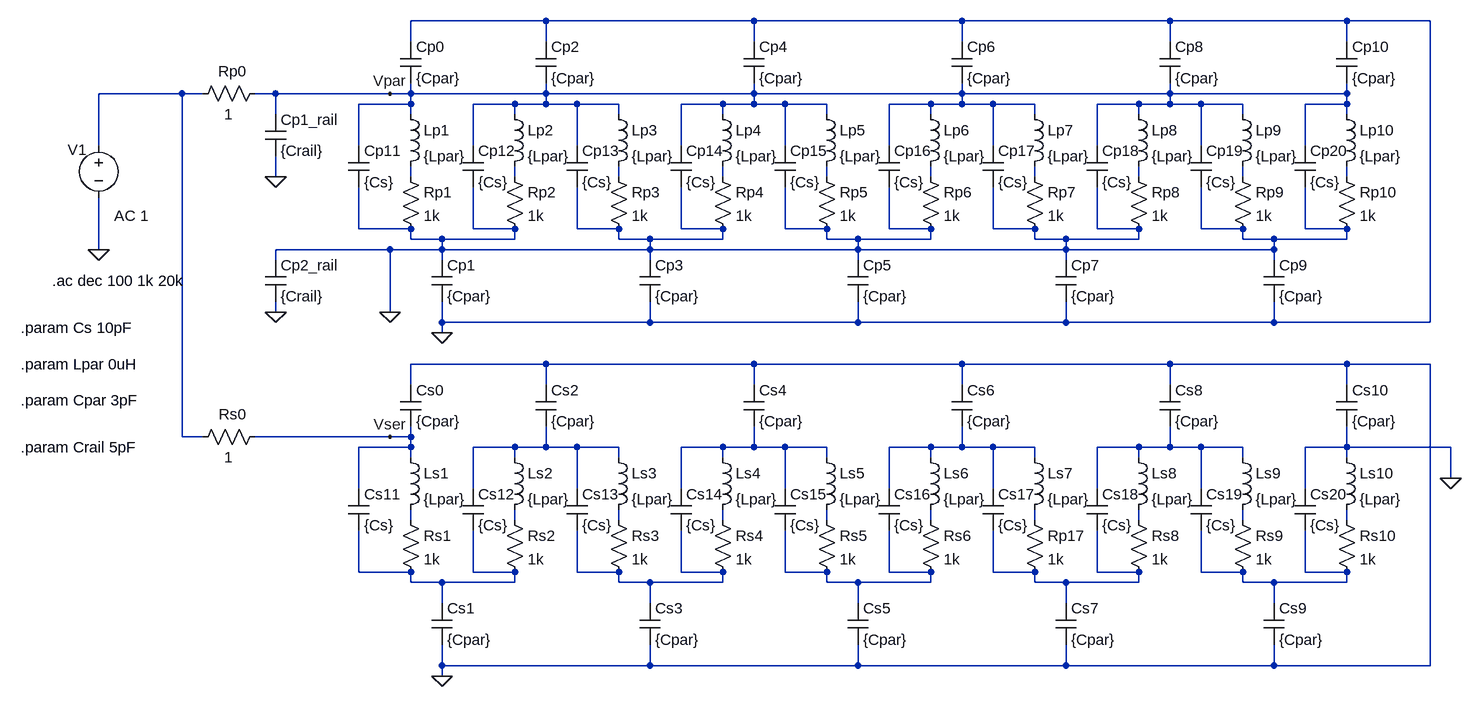
[diagram p0: schematic Hamon_RLC_Transfer.asc]
Hamon_RLC_Transfer.asc, the LTspice schematic file:
Version 4
SHEET 1 1508 1156
WIRE 48 -80 -160 -80
WIRE 368 -80 48 -80
WIRE 688 -80 368 -80
WIRE 1008 -80 688 -80
WIRE 1280 -80 1008 -80
WIRE 1408 -80 1280 -80
WIRE -160 -48 -160 -80
WIRE 48 -48 48 -80
WIRE 368 -48 368 -80
WIRE 688 -48 688 -80
WIRE 1008 -48 1008 -80
WIRE 1280 -48 1280 -80
WIRE -512 32 -640 32
WIRE -480 32 -512 32
WIRE -368 32 -400 32
WIRE -192 32 -368 32
WIRE -160 32 -160 16
WIRE -160 32 -192 32
WIRE 48 32 48 16
WIRE 48 32 -160 32
WIRE 368 32 368 16
WIRE 368 32 48 32
WIRE 688 32 688 16
WIRE 688 32 368 32
WIRE 1008 32 1008 16
WIRE 1008 32 688 32
WIRE 1280 32 1280 16
WIRE 1280 32 1008 32
WIRE -160 48 -160 32
WIRE -160 48 -240 48
WIRE 0 48 -64 48
WIRE 48 48 48 32
WIRE 48 48 0 48
WIRE 96 48 48 48
WIRE 160 48 96 48
WIRE 320 48 256 48
WIRE 368 48 368 32
WIRE 368 48 320 48
WIRE 416 48 368 48
WIRE 480 48 416 48
WIRE 640 48 576 48
WIRE 688 48 688 32
WIRE 688 48 640 48
WIRE 736 48 688 48
WIRE 800 48 736 48
WIRE 960 48 896 48
WIRE 1008 48 1008 32
WIRE 1008 48 960 48
WIRE 1056 48 1008 48
WIRE 1120 48 1056 48
WIRE 1280 48 1280 32
WIRE 1280 48 1216 48
WIRE -368 64 -368 32
WIRE -160 64 -160 48
WIRE 0 64 0 48
WIRE 160 64 160 48
WIRE 320 64 320 48
WIRE 480 64 480 48
WIRE 640 64 640 48
WIRE 800 64 800 48
WIRE 960 64 960 48
WIRE 1120 64 1120 48
WIRE 1280 64 1280 48
WIRE -640 112 -640 32
WIRE -240 112 -240 48
WIRE -64 112 -64 48
WIRE 96 112 96 48
WIRE 256 112 256 48
WIRE 416 112 416 48
WIRE 576 112 576 48
WIRE 736 112 736 48
WIRE 896 112 896 48
WIRE 1056 112 1056 48
WIRE 1216 112 1216 48
WIRE -368 160 -368 128
WIRE -160 160 -160 144
WIRE 0 160 0 144
WIRE 160 160 160 144
WIRE 320 160 320 144
WIRE 480 160 480 144
WIRE 640 160 640 144
WIRE 800 160 800 144
WIRE 960 160 960 144
WIRE 1120 160 1120 144
WIRE 1280 160 1280 144
WIRE -240 240 -240 176
WIRE -160 240 -240 240
WIRE -64 240 -64 176
WIRE 0 240 -64 240
WIRE 96 240 96 176
WIRE 160 240 96 240
WIRE 256 240 256 176
WIRE 320 240 256 240
WIRE 416 240 416 176
WIRE 480 240 416 240
WIRE 576 240 576 176
WIRE 640 240 576 240
WIRE 736 240 736 176
WIRE 800 240 736 240
WIRE 896 240 896 176
WIRE 960 240 896 240
WIRE 1056 240 1056 176
WIRE 1120 240 1056 240
WIRE 1216 240 1216 176
WIRE 1280 240 1216 240
WIRE -160 256 -160 240
WIRE -112 256 -160 256
WIRE 0 256 0 240
WIRE 0 256 -112 256
WIRE 160 256 160 240
WIRE 208 256 160 256
WIRE 320 256 320 240
WIRE 320 256 208 256
WIRE 480 256 480 240
WIRE 528 256 480 256
WIRE 640 256 640 240
WIRE 640 256 528 256
WIRE 800 256 800 240
WIRE 848 256 800 256
WIRE 960 256 960 240
WIRE 960 256 848 256
WIRE 1120 256 1120 240
WIRE 1168 256 1120 256
WIRE 1280 256 1280 240
WIRE 1280 256 1168 256
WIRE -640 272 -640 192
WIRE -192 272 -368 272
WIRE -112 272 -112 256
WIRE -112 272 -192 272
WIRE 208 272 208 256
WIRE 208 272 -112 272
WIRE 528 272 528 256
WIRE 528 272 208 272
WIRE 848 272 848 256
WIRE 848 272 528 272
WIRE 1168 272 1168 256
WIRE 1168 272 848 272
WIRE -368 288 -368 272
WIRE -112 288 -112 272
WIRE 208 288 208 272
WIRE 528 288 528 272
WIRE 848 288 848 272
WIRE 1168 288 1168 272
WIRE -368 368 -368 352
WIRE -192 368 -192 272
WIRE -112 384 -112 352
WIRE 208 384 208 352
WIRE 208 384 -112 384
WIRE 528 384 528 352
WIRE 528 384 208 384
WIRE 848 384 848 352
WIRE 848 384 528 384
WIRE 1168 384 1168 352
WIRE 1168 384 848 384
WIRE 1408 384 1408 -80
WIRE 1408 384 1168 384
WIRE -112 400 -112 384
WIRE 48 448 -160 448
WIRE 368 448 48 448
WIRE 688 448 368 448
WIRE 1008 448 688 448
WIRE 1280 448 1008 448
WIRE 1408 448 1280 448
WIRE -160 480 -160 448
WIRE 48 480 48 448
WIRE 368 480 368 448
WIRE 688 480 688 448
WIRE 1008 480 1008 448
WIRE 1280 480 1280 448
WIRE -512 560 -512 32
WIRE -480 560 -512 560
WIRE -192 560 -400 560
WIRE -160 560 -160 544
WIRE -160 560 -192 560
WIRE -160 576 -160 560
WIRE -160 576 -240 576
WIRE 0 576 -64 576
WIRE 48 576 48 544
WIRE 48 576 0 576
WIRE 96 576 48 576
WIRE 160 576 96 576
WIRE 320 576 256 576
WIRE 368 576 368 544
WIRE 368 576 320 576
WIRE 416 576 368 576
WIRE 480 576 416 576
WIRE 640 576 576 576
WIRE 688 576 688 544
WIRE 688 576 640 576
WIRE 736 576 688 576
WIRE 800 576 736 576
WIRE 960 576 896 576
WIRE 1008 576 1008 544
WIRE 1008 576 960 576
WIRE 1056 576 1008 576
WIRE 1120 576 1056 576
WIRE 1280 576 1280 544
WIRE 1280 576 1216 576
WIRE 1440 576 1280 576
WIRE -160 592 -160 576
WIRE 0 592 0 576
WIRE 160 592 160 576
WIRE 320 592 320 576
WIRE 480 592 480 576
WIRE 640 592 640 576
WIRE 800 592 800 576
WIRE 960 592 960 576
WIRE 1120 592 1120 576
WIRE 1280 592 1280 576
WIRE 1440 624 1440 576
WIRE -240 640 -240 576
WIRE -64 640 -64 576
WIRE 96 640 96 576
WIRE 256 640 256 576
WIRE 416 640 416 576
WIRE 576 640 576 576
WIRE 736 640 736 576
WIRE 896 640 896 576
WIRE 1056 640 1056 576
WIRE 1216 640 1216 576
WIRE -160 688 -160 672
WIRE 0 688 0 672
WIRE 160 688 160 672
WIRE 320 688 320 672
WIRE 480 688 480 672
WIRE 640 688 640 672
WIRE 800 688 800 672
WIRE 960 688 960 672
WIRE 1120 688 1120 672
WIRE 1280 688 1280 672
WIRE -240 768 -240 704
WIRE -160 768 -240 768
WIRE -64 768 -64 704
WIRE 0 768 -64 768
WIRE 96 768 96 704
WIRE 160 768 96 768
WIRE 256 768 256 704
WIRE 320 768 256 768
WIRE 416 768 416 704
WIRE 480 768 416 768
WIRE 576 768 576 704
WIRE 640 768 576 768
WIRE 736 768 736 704
WIRE 800 768 736 768
WIRE 896 768 896 704
WIRE 960 768 896 768
WIRE 1056 768 1056 704
WIRE 1120 768 1056 768
WIRE 1216 768 1216 704
WIRE 1280 768 1216 768
WIRE -160 784 -160 768
WIRE -112 784 -160 784
WIRE 0 784 0 768
WIRE 0 784 -112 784
WIRE 160 784 160 768
WIRE 208 784 160 784
WIRE 320 784 320 768
WIRE 320 784 208 784
WIRE 480 784 480 768
WIRE 528 784 480 784
WIRE 640 784 640 768
WIRE 640 784 528 784
WIRE 800 784 800 768
WIRE 848 784 800 784
WIRE 960 784 960 768
WIRE 960 784 848 784
WIRE 1120 784 1120 768
WIRE 1168 784 1120 784
WIRE 1280 784 1280 768
WIRE 1280 784 1168 784
WIRE -112 816 -112 784
WIRE 208 816 208 784
WIRE 528 816 528 784
WIRE 848 816 848 784
WIRE 1168 816 1168 784
WIRE -112 912 -112 880
WIRE 208 912 208 880
WIRE 208 912 -112 912
WIRE 528 912 528 880
WIRE 528 912 208 912
WIRE 848 912 848 880
WIRE 848 912 528 912
WIRE 1168 912 1168 880
WIRE 1168 912 848 912
WIRE 1408 912 1408 448
WIRE 1408 912 1168 912
WIRE -112 928 -112 912
FLAG -640 272 0
FLAG -112 400 0
FLAG -192 32 Vpar
FLAG -192 368 0
FLAG -368 160 0
FLAG -112 928 0
FLAG -192 560 Vser
FLAG 1440 624 0
FLAG -368 368 0
SYMBOL res -176 144 R0
SYMATTR InstName Rp1
SYMATTR Value 1k
SYMBOL res -16 144 R0
SYMATTR InstName Rp2
SYMATTR Value 1k
SYMBOL res 144 144 R0
SYMATTR InstName Rp3
SYMATTR Value 1k
SYMBOL res 304 144 R0
SYMATTR InstName Rp4
SYMATTR Value 1k
SYMBOL res 464 144 R0
SYMATTR InstName Rp5
SYMATTR Value 1k
SYMBOL res 624 144 R0
SYMATTR InstName Rp6
SYMATTR Value 1k
SYMBOL res 784 144 R0
SYMATTR InstName Rp7
SYMATTR Value 1k
SYMBOL res 944 144 R0
SYMATTR InstName Rp8
SYMATTR Value 1k
SYMBOL res 1104 144 R0
SYMATTR InstName Rp9
SYMATTR Value 1k
SYMBOL res 1264 144 R0
SYMATTR InstName Rp10
SYMATTR Value 1k
SYMBOL ind -176 48 R0
SYMATTR InstName Lp1
SYMATTR Value {Lpar}
SYMBOL ind -16 48 R0
SYMATTR InstName Lp2
SYMATTR Value {Lpar}
SYMBOL ind 144 48 R0
SYMATTR InstName Lp3
SYMATTR Value {Lpar}
SYMBOL ind 304 48 R0
SYMATTR InstName Lp4
SYMATTR Value {Lpar}
SYMBOL ind 464 48 R0
SYMATTR InstName Lp5
SYMATTR Value {Lpar}
SYMBOL ind 624 48 R0
SYMATTR InstName Lp6
SYMATTR Value {Lpar}
SYMBOL ind 784 48 R0
SYMATTR InstName Lp7
SYMATTR Value {Lpar}
SYMBOL ind 944 48 R0
SYMATTR InstName Lp8
SYMATTR Value {Lpar}
SYMBOL ind 1104 48 R0
SYMATTR InstName Lp9
SYMATTR Value {Lpar}
SYMBOL ind 1264 48 R0
SYMATTR InstName Lp10
SYMATTR Value {Lpar}
SYMBOL cap -128 288 R0
SYMATTR InstName Cp1
SYMATTR Value {Cpar}
SYMBOL cap 32 -48 R0
SYMATTR InstName Cp2
SYMATTR Value {Cpar}
SYMBOL cap 192 288 R0
SYMATTR InstName Cp3
SYMATTR Value {Cpar}
SYMBOL cap 352 -48 R0
SYMATTR InstName Cp4
SYMATTR Value {Cpar}
SYMBOL cap 512 288 R0
SYMATTR InstName Cp5
SYMATTR Value {Cpar}
SYMBOL cap 672 -48 R0
SYMATTR InstName Cp6
SYMATTR Value {Cpar}
SYMBOL cap 832 288 R0
SYMATTR InstName Cp7
SYMATTR Value {Cpar}
SYMBOL cap 992 -48 R0
SYMATTR InstName Cp8
SYMATTR Value {Cpar}
SYMBOL cap 1152 288 R0
SYMATTR InstName Cp9
SYMATTR Value {Cpar}
SYMBOL cap 1264 -48 R0
SYMATTR InstName Cp10
SYMATTR Value {Cpar}
SYMBOL cap -176 -48 R0
SYMATTR InstName Cp0
SYMATTR Value {Cpar}
SYMBOL voltage -640 96 R0
WINDOW 123 24 124 Left 2
WINDOW 39 0 0 Left 0
WINDOW 0 -48 22 Left 2
SYMATTR Value2 AC 1
SYMATTR InstName V1
SYMATTR Value ""
SYMBOL res -384 16 R90
WINDOW 0 -3 50 VBottom 2
WINDOW 3 32 56 VTop 2
SYMATTR InstName Rp0
SYMATTR Value 1
SYMBOL cap -256 112 R0
SYMATTR InstName Cp11
SYMATTR Value {Cs}
SYMBOL cap -80 112 R0
SYMATTR InstName Cp12
SYMATTR Value {Cs}
SYMBOL cap 80 112 R0
SYMATTR InstName Cp13
SYMATTR Value {Cs}
SYMBOL cap 240 112 R0
SYMATTR InstName Cp14
SYMATTR Value {Cs}
SYMBOL cap 400 112 R0
SYMATTR InstName Cp15
SYMATTR Value {Cs}
SYMBOL cap 560 112 R0
SYMATTR InstName Cp16
SYMATTR Value {Cs}
SYMBOL cap 720 112 R0
SYMATTR InstName Cp17
SYMATTR Value {Cs}
SYMBOL cap 880 112 R0
SYMATTR InstName Cp18
SYMATTR Value {Cs}
SYMBOL cap 1040 112 R0
SYMATTR InstName Cp19
SYMATTR Value {Cs}
SYMBOL cap 1200 112 R0
SYMATTR InstName Cp20
SYMATTR Value {Cs}
SYMBOL cap -384 64 R0
SYMATTR InstName Cp1_rail
SYMATTR Value {Crail}
SYMBOL res -176 672 R0
SYMATTR InstName Rs1
SYMATTR Value 1k
SYMBOL res -16 672 R0
SYMATTR InstName Rs2
SYMATTR Value 1k
SYMBOL res 144 672 R0
SYMATTR InstName Rs3
SYMATTR Value 1k
SYMBOL res 304 672 R0
SYMATTR InstName Rs4
SYMATTR Value 1k
SYMBOL res 464 672 R0
SYMATTR InstName Rs5
SYMATTR Value 1k
SYMBOL res 624 672 R0
SYMATTR InstName Rs6
SYMATTR Value 1k
SYMBOL res 784 672 R0
SYMATTR InstName Rp17
SYMATTR Value 1k
SYMBOL res 944 672 R0
SYMATTR InstName Rs8
SYMATTR Value 1k
SYMBOL res 1104 672 R0
SYMATTR InstName Rs9
SYMATTR Value 1k
SYMBOL res 1264 672 R0
SYMATTR InstName Rs10
SYMATTR Value 1k
SYMBOL ind -176 576 R0
SYMATTR InstName Ls1
SYMATTR Value {Lpar}
SYMBOL ind -16 576 R0
SYMATTR InstName Ls2
SYMATTR Value {Lpar}
SYMBOL ind 144 576 R0
SYMATTR InstName Ls3
SYMATTR Value {Lpar}
SYMBOL ind 304 576 R0
SYMATTR InstName Ls4
SYMATTR Value {Lpar}
SYMBOL ind 464 576 R0
SYMATTR InstName Ls5
SYMATTR Value {Lpar}
SYMBOL ind 624 576 R0
SYMATTR InstName Ls6
SYMATTR Value {Lpar}
SYMBOL ind 784 576 R0
SYMATTR InstName Ls7
SYMATTR Value {Lpar}
SYMBOL ind 944 576 R0
SYMATTR InstName Ls8
SYMATTR Value {Lpar}
SYMBOL ind 1104 576 R0
SYMATTR InstName Ls9
SYMATTR Value {Lpar}
SYMBOL ind 1264 576 R0
SYMATTR InstName Ls10
SYMATTR Value {Lpar}
SYMBOL cap -128 816 R0
SYMATTR InstName Cs1
SYMATTR Value {Cpar}
SYMBOL cap 32 480 R0
SYMATTR InstName Cs2
SYMATTR Value {Cpar}
SYMBOL cap 192 816 R0
SYMATTR InstName Cs3
SYMATTR Value {Cpar}
SYMBOL cap 352 480 R0
SYMATTR InstName Cs4
SYMATTR Value {Cpar}
SYMBOL cap 512 816 R0
SYMATTR InstName Cs5
SYMATTR Value {Cpar}
SYMBOL cap 672 480 R0
SYMATTR InstName Cs6
SYMATTR Value {Cpar}
SYMBOL cap 832 816 R0
SYMATTR InstName Cs7
SYMATTR Value {Cpar}
SYMBOL cap 992 480 R0
SYMATTR InstName Cs8
SYMATTR Value {Cpar}
SYMBOL cap 1152 816 R0
SYMATTR InstName Cs9
SYMATTR Value {Cpar}
SYMBOL cap 1264 480 R0
SYMATTR InstName Cs10
SYMATTR Value {Cpar}
SYMBOL cap -176 480 R0
SYMATTR InstName Cs0
SYMATTR Value {Cpar}
SYMBOL res -384 544 R90
WINDOW 0 -3 50 VBottom 2
WINDOW 3 32 56 VTop 2
SYMATTR InstName Rs0
SYMATTR Value 1
SYMBOL cap -256 640 R0
SYMATTR InstName Cs11
SYMATTR Value {Cs}
SYMBOL cap -80 640 R0
SYMATTR InstName Cs12
SYMATTR Value {Cs}
SYMBOL cap 80 640 R0
SYMATTR InstName Cs13
SYMATTR Value {Cs}
SYMBOL cap 240 640 R0
SYMATTR InstName Cs14
SYMATTR Value {Cs}
SYMBOL cap 400 640 R0
SYMATTR InstName Cs15
SYMATTR Value {Cs}
SYMBOL cap 560 640 R0
SYMATTR InstName Cs16
SYMATTR Value {Cs}
SYMBOL cap 720 640 R0
SYMATTR InstName Cs17
SYMATTR Value {Cs}
SYMBOL cap 880 640 R0
SYMATTR InstName Cs18
SYMATTR Value {Cs}
SYMBOL cap 1040 640 R0
SYMATTR InstName Cs19
SYMATTR Value {Cs}
SYMBOL cap 1200 640 R0
SYMATTR InstName Cs20
SYMATTR Value {Cs}
SYMBOL cap -384 288 R0
SYMATTR InstName Cp2_rail
SYMATTR Value {Crail}
TEXT -712 320 Left 2 !.ac dec 100 1k 20k
TEXT -760 448 Left 2 !.param Lpar 0uH
TEXT -760 504 Left 2 !.param Cpar 3pF
TEXT -760 392 Left 2 !.param Cs 10pF
TEXT -760 576 Left 2 !.param Crail 5pF

The netlist it stands for:
* Hamon_RLC_Transfer.asc
Rp1 N002 0 1k
Rp2 N003 0 1k
Rp3 N004 0 1k
Rp4 N005 0 1k
Rp5 N006 0 1k
Rp6 N007 0 1k
Rp7 N008 0 1k
Rp8 N009 0 1k
Rp9 N010 0 1k
Rp10 N011 0 1k
Lp1 Vpar N002 {Lpar}
Lp2 Vpar N003 {Lpar}
Lp3 Vpar N004 {Lpar}
Lp4 Vpar N005 {Lpar}
Lp5 Vpar N006 {Lpar}
Lp6 Vpar N007 {Lpar}
Lp7 Vpar N008 {Lpar}
Lp8 Vpar N009 {Lpar}
Lp9 Vpar N010 {Lpar}
Lp10 Vpar N011 {Lpar}
Cp1 0 0 {Cpar}
Cp2 0 Vpar {Cpar}
Cp3 0 0 {Cpar}
Cp4 0 Vpar {Cpar}
Cp5 0 0 {Cpar}
Cp6 0 Vpar {Cpar}
Cp7 0 0 {Cpar}
Cp8 0 Vpar {Cpar}
Cp9 0 0 {Cpar}
Cp10 0 Vpar {Cpar}
Cp0 0 Vpar {Cpar}
V1 N001 0 AC 1
Rp0 Vpar N001 1
Cp11 Vpar 0 {Cs}
Cp12 Vpar 0 {Cs}
Cp13 Vpar 0 {Cs}
Cp14 Vpar 0 {Cs}
Cp15 Vpar 0 {Cs}
Cp16 Vpar 0 {Cs}
Cp17 Vpar 0 {Cs}
Cp18 Vpar 0 {Cs}
Cp19 Vpar 0 {Cs}
Cp20 Vpar 0 {Cs}
Cp1_rail Vpar 0 {Crail}
Rs1 N016 N026 1k
Rs2 N017 N026 1k
Rs3 N018 N027 1k
Rs4 N019 N027 1k
Rs5 N020 N028 1k
Rs6 N021 N028 1k
Rp17 N022 N029 1k
Rs8 N023 N029 1k
Rs9 N024 N030 1k
Rs10 N025 N030 1k
Ls1 Vser N016 {Lpar}
Ls2 N012 N017 {Lpar}
Ls3 N012 N018 {Lpar}
Ls4 N013 N019 {Lpar}
Ls5 N013 N020 {Lpar}
Ls6 N014 N021 {Lpar}
Ls7 N014 N022 {Lpar}
Ls8 N015 N023 {Lpar}
Ls9 N015 N024 {Lpar}
Ls10 0 N025 {Lpar}
Cs1 N026 0 {Cpar}
Cs2 0 N012 {Cpar}
Cs3 N027 0 {Cpar}
Cs4 0 N013 {Cpar}
Cs5 N028 0 {Cpar}
Cs6 0 N014 {Cpar}
Cs7 N029 0 {Cpar}
Cs8 0 N015 {Cpar}
Cs9 N030 0 {Cpar}
Cs10 0 0 {Cpar}
Cs0 0 Vser {Cpar}
Rs0 Vser N001 1
Cs11 Vser N026 {Cs}
Cs12 N012 N026 {Cs}
Cs13 N012 N027 {Cs}
Cs14 N013 N027 {Cs}
Cs15 N013 N028 {Cs}
Cs16 N014 N028 {Cs}
Cs17 N014 N029 {Cs}
Cs18 N015 N029 {Cs}
Cs19 N015 N030 {Cs}
Cs20 0 N030 {Cs}
Cp2_rail 0 0 {Crail}
.ac dec 100 1k 20k
.param Lpar 0uH
.param Cpar 3pF
.param Cs 10pF
.param Crail 5pF
.backanno
.end